# EAGLE design PCU_Testboard (EAGLE 9.5.1)

## Sheet 1 of 6: Connectors
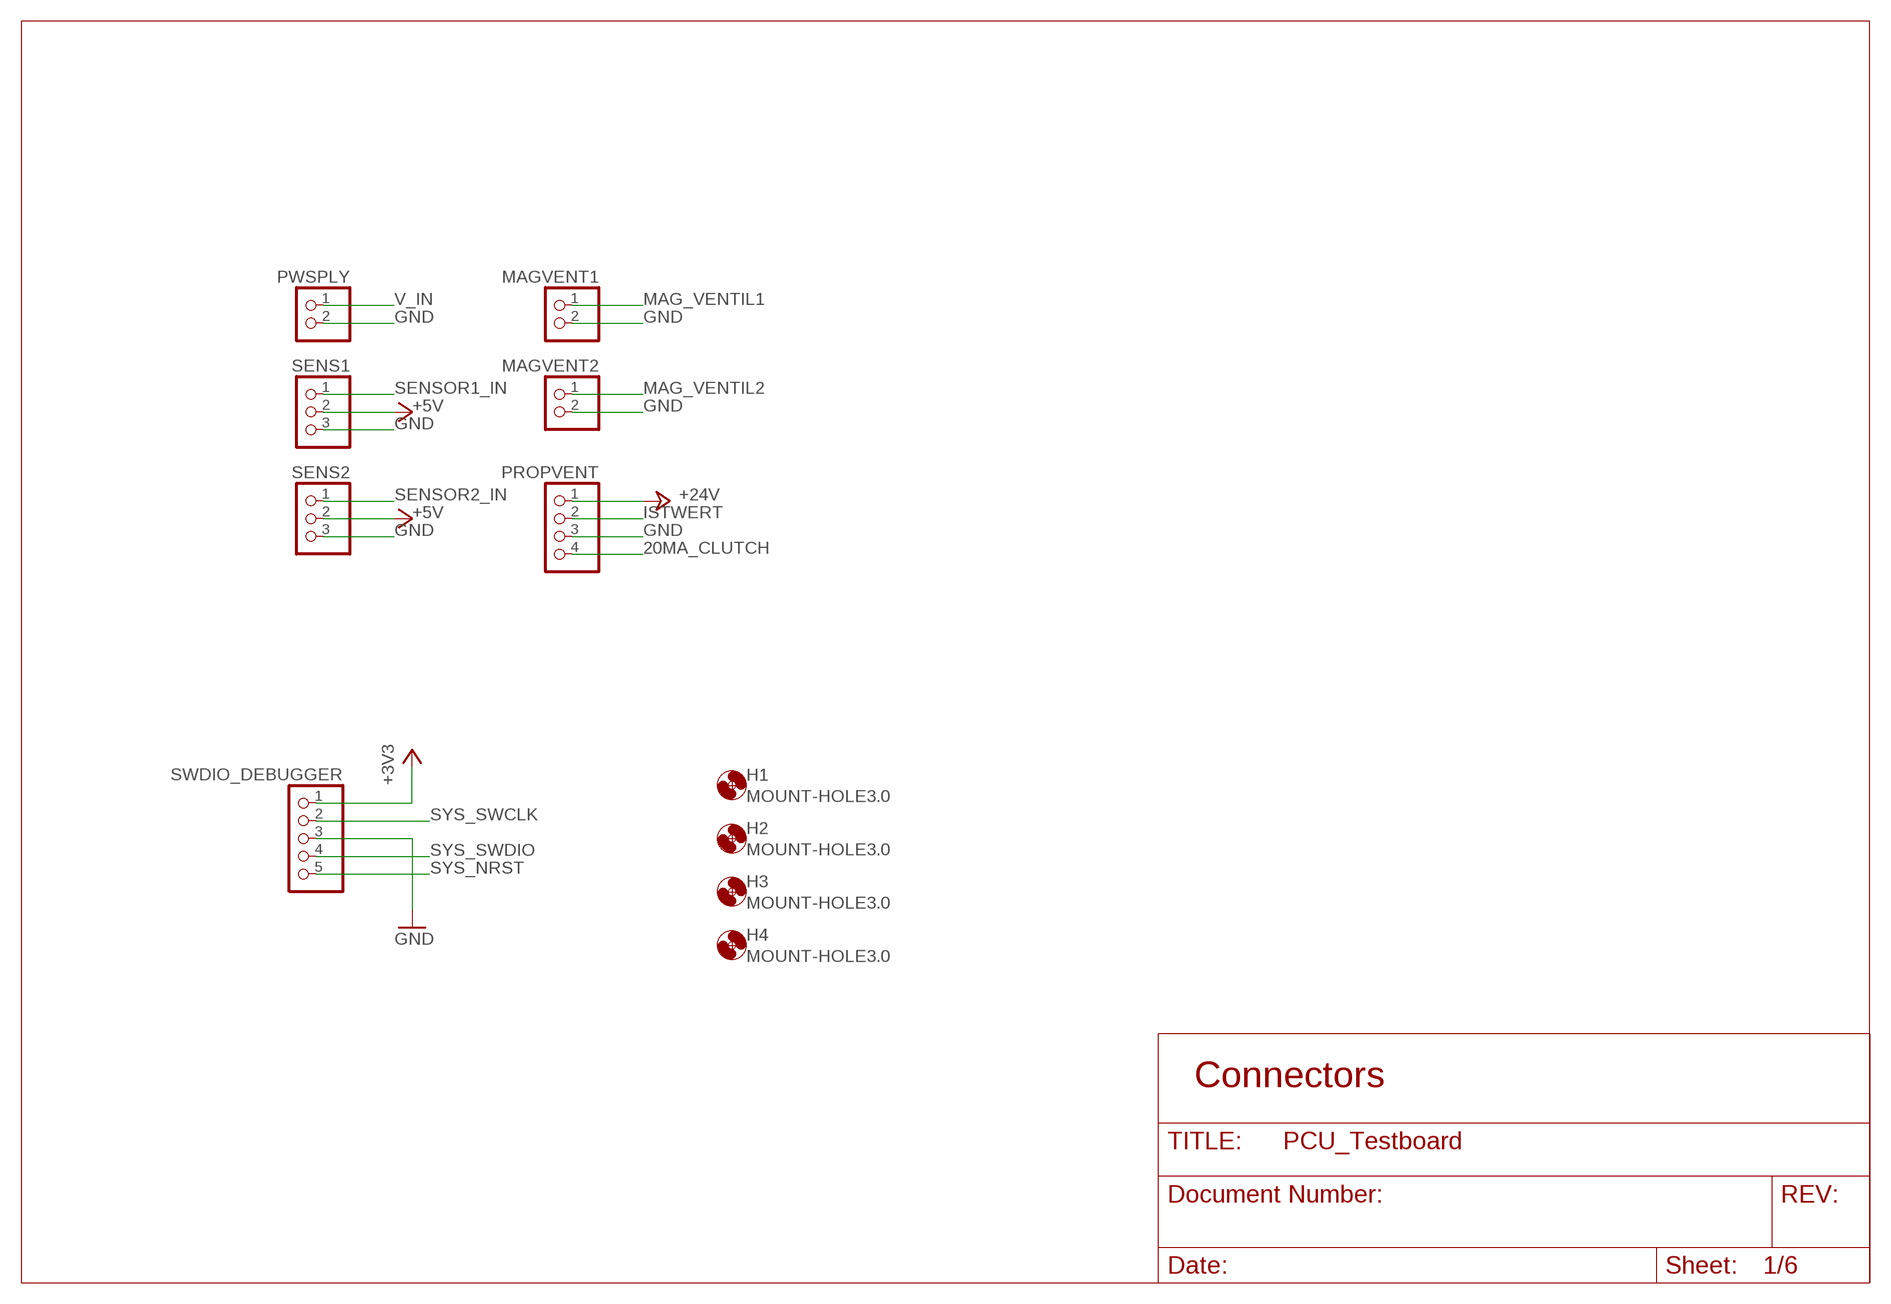
[diagram p0: schematic, sheet 1]

### Parts
H1  MOUNT-HOLE3.0  [3,0]
H2  MOUNT-HOLE3.0  [3,0]
H3  MOUNT-HOLE3.0  [3,0]
H4  MOUNT-HOLE3.0  [3,0]
MAGVENT1  PINHD-1X2  [1X02]
MAGVENT2  PINHD-1X2  [1X02]
PROPVENT  PINHD-1X4  [1X04]
PWSPLY  PINHD-1X2  [1X02]
SENS1  PINHD-1X3  [1X03]
SENS2  PINHD-1X3  [1X03]
SWDIO_DEBUGGER  PINHD-1X5  [1X05]

### Nets
20MA_CLUTCH: PROPVENT.4 ; also sheet 4
+3V3: SWDIO_DEBUGGER.1 ; also sheet 2,3,5
+5V: SENS1.2 SENS2.2 ; also sheet 3,6
+24V: PROPVENT.1 ; also sheet 3,4
GND: MAGVENT1.2 MAGVENT2.2 PROPVENT.3 PWSPLY.2 SENS1.3 SENS2.3 SWDIO_DEBUGGER.3 ; also sheet 2,3,4,5,6
ISTWERT: PROPVENT.2 ; also sheet 2,5
MAG_VENTIL1: MAGVENT1.1 ; also sheet 4
MAG_VENTIL2: MAGVENT2.1 ; also sheet 4
SENSOR1_IN: SENS1.1 ; also sheet 6
SENSOR2_IN: SENS2.1 ; also sheet 6
SYS_NRST: SWDIO_DEBUGGER.5
SYS_SWCLK: SWDIO_DEBUGGER.2 ; also sheet 2
SYS_SWDIO: SWDIO_DEBUGGER.4 ; also sheet 2
V_IN: PWSPLY.1 ; also sheet 3

### Notes on the sheet
- Connectors

## Sheet 2 of 6: Microcontroller Pinout
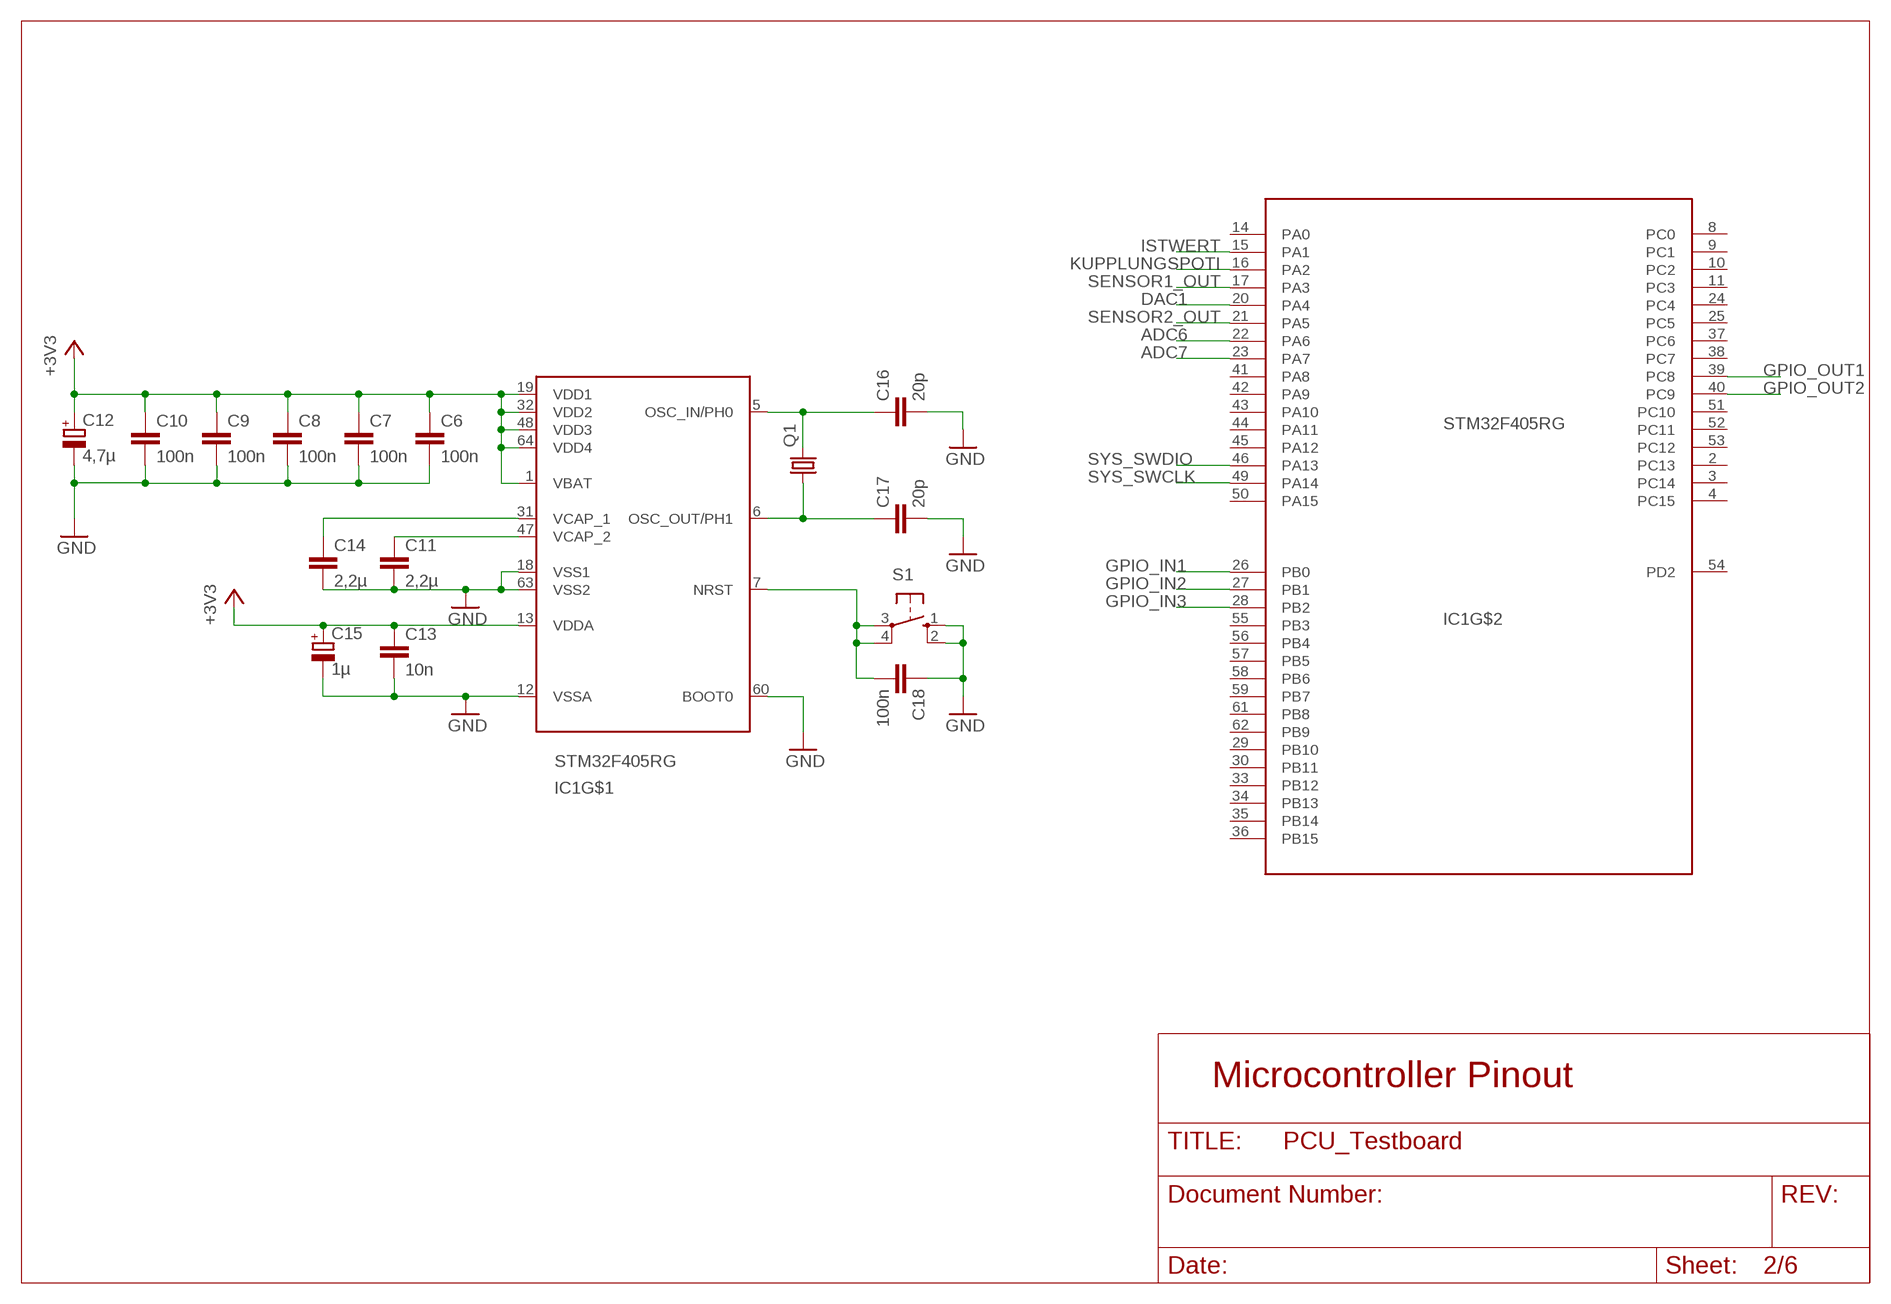
[diagram p1: schematic, sheet 2]

### Parts
C6  100n  C-EUC0603  [C0603]
C7  100n  C-EUC0603  [C0603]
C8  100n  C-EUC0603  [C0603]
C9  100n  C-EUC0603  [C0603]
C10  100n  C-EUC0603  [C0603]
C11  2,2µ  C-EUC0603  [C0603]
C12  4,7µ  CPOL-EU153CLV-0505  [153CLV-0505]
C13  10n  C-EUC0603  [C0603]
C14  2,2µ  C-EUC0603  [C0603]
C15  1µ  CPOL-EU153CLV-0505  [153CLV-0505]
C16  20p  C-EUC0603  [C0603]
C17  20p  C-EUC0603  [C0603]
C18  100n  C-EUC0603  [C0603]
IC1  STM32F405RG  [LQFP64]
Q1  CRYSTALHC49UP  [HC49UP]
S1  10-XX  [B3F-10XX]

### Nets
+3V3: C6.1 C7.1 C8.1 C9.1 C10.1 C12.+ C13.1 C15.+ IC1.1(VBAT) IC1.13(VDDA) IC1.19(VDD1) IC1.32(VDD2) IC1.48(VDD3) IC1.64(VDD4) ; also sheet 1,3,5
ADC6: IC1.22(PA6)
ADC7: IC1.23(PA7)
DAC1: IC1.20(PA4) ; also sheet 4
GND: C6.2 C7.2 C8.2 C9.2 C10.2 C11.2 C12.- C13.2 C14.2 C15.- C16.2 C17.2 C18.1 IC1.12(VSSA) IC1.18(VSS1) IC1.60(BOOT0) IC1.63(VSS2) S1.1(S) S1.2(S1) ; also sheet 1,3,4,5,6
GPIO_IN1: IC1.26(PB0) ; also sheet 5
GPIO_IN2: IC1.27(PB1) ; also sheet 5
GPIO_IN3: IC1.28(PB2) ; also sheet 5
GPIO_OUT1: IC1.39(PC8) ; also sheet 4
GPIO_OUT2: IC1.40(PC9) ; also sheet 4
ISTWERT: IC1.15(PA1) ; also sheet 1,5
KUPPLUNGSPOTI: IC1.16(PA2) ; also sheet 5
N$1: C14.1 IC1.31(VCAP_1)
N$2: C11.1 IC1.47(VCAP_2)
N$5: C16.1 IC1.5(OSC_IN/PH0) Q1.2
N$6: C17.1 IC1.6(OSC_OUT/PH1) Q1.1
N$8: C18.2 IC1.7(NRST) S1.3(P) S1.4(P1)
SENSOR1_OUT: IC1.17(PA3) ; also sheet 6
SENSOR2_OUT: IC1.21(PA5) ; also sheet 6
SYS_SWCLK: IC1.49(PA14) ; also sheet 1
SYS_SWDIO: IC1.46(PA13) ; also sheet 1
Unconnected: IC1.2(PC13) IC1.3(PC14) IC1.4(PC15) IC1.8(PC0) IC1.9(PC1) IC1.10(PC2) IC1.11(PC3) IC1.14(PA0) IC1.24(PC4) IC1.25(PC5) IC1.29(PB10) IC1.30(PB11) IC1.33(PB12) IC1.34(PB13) IC1.35(PB14) IC1.36(PB15) IC1.37(PC6) IC1.38(PC7) IC1.41(PA8) IC1.42(PA9) IC1.43(PA10) IC1.44(PA11) IC1.45(PA12) IC1.50(PA15) IC1.51(PC10) IC1.52(PC11) IC1.53(PC12) IC1.54(PD2) IC1.55(PB3) IC1.56(PB4) IC1.57(PB5) IC1.58(PB6) IC1.59(PB7) IC1.61(PB8) IC1.62(PB9)

### Notes on the sheet
- Microcontroller Pinout

## Sheet 3 of 6: Power Supply
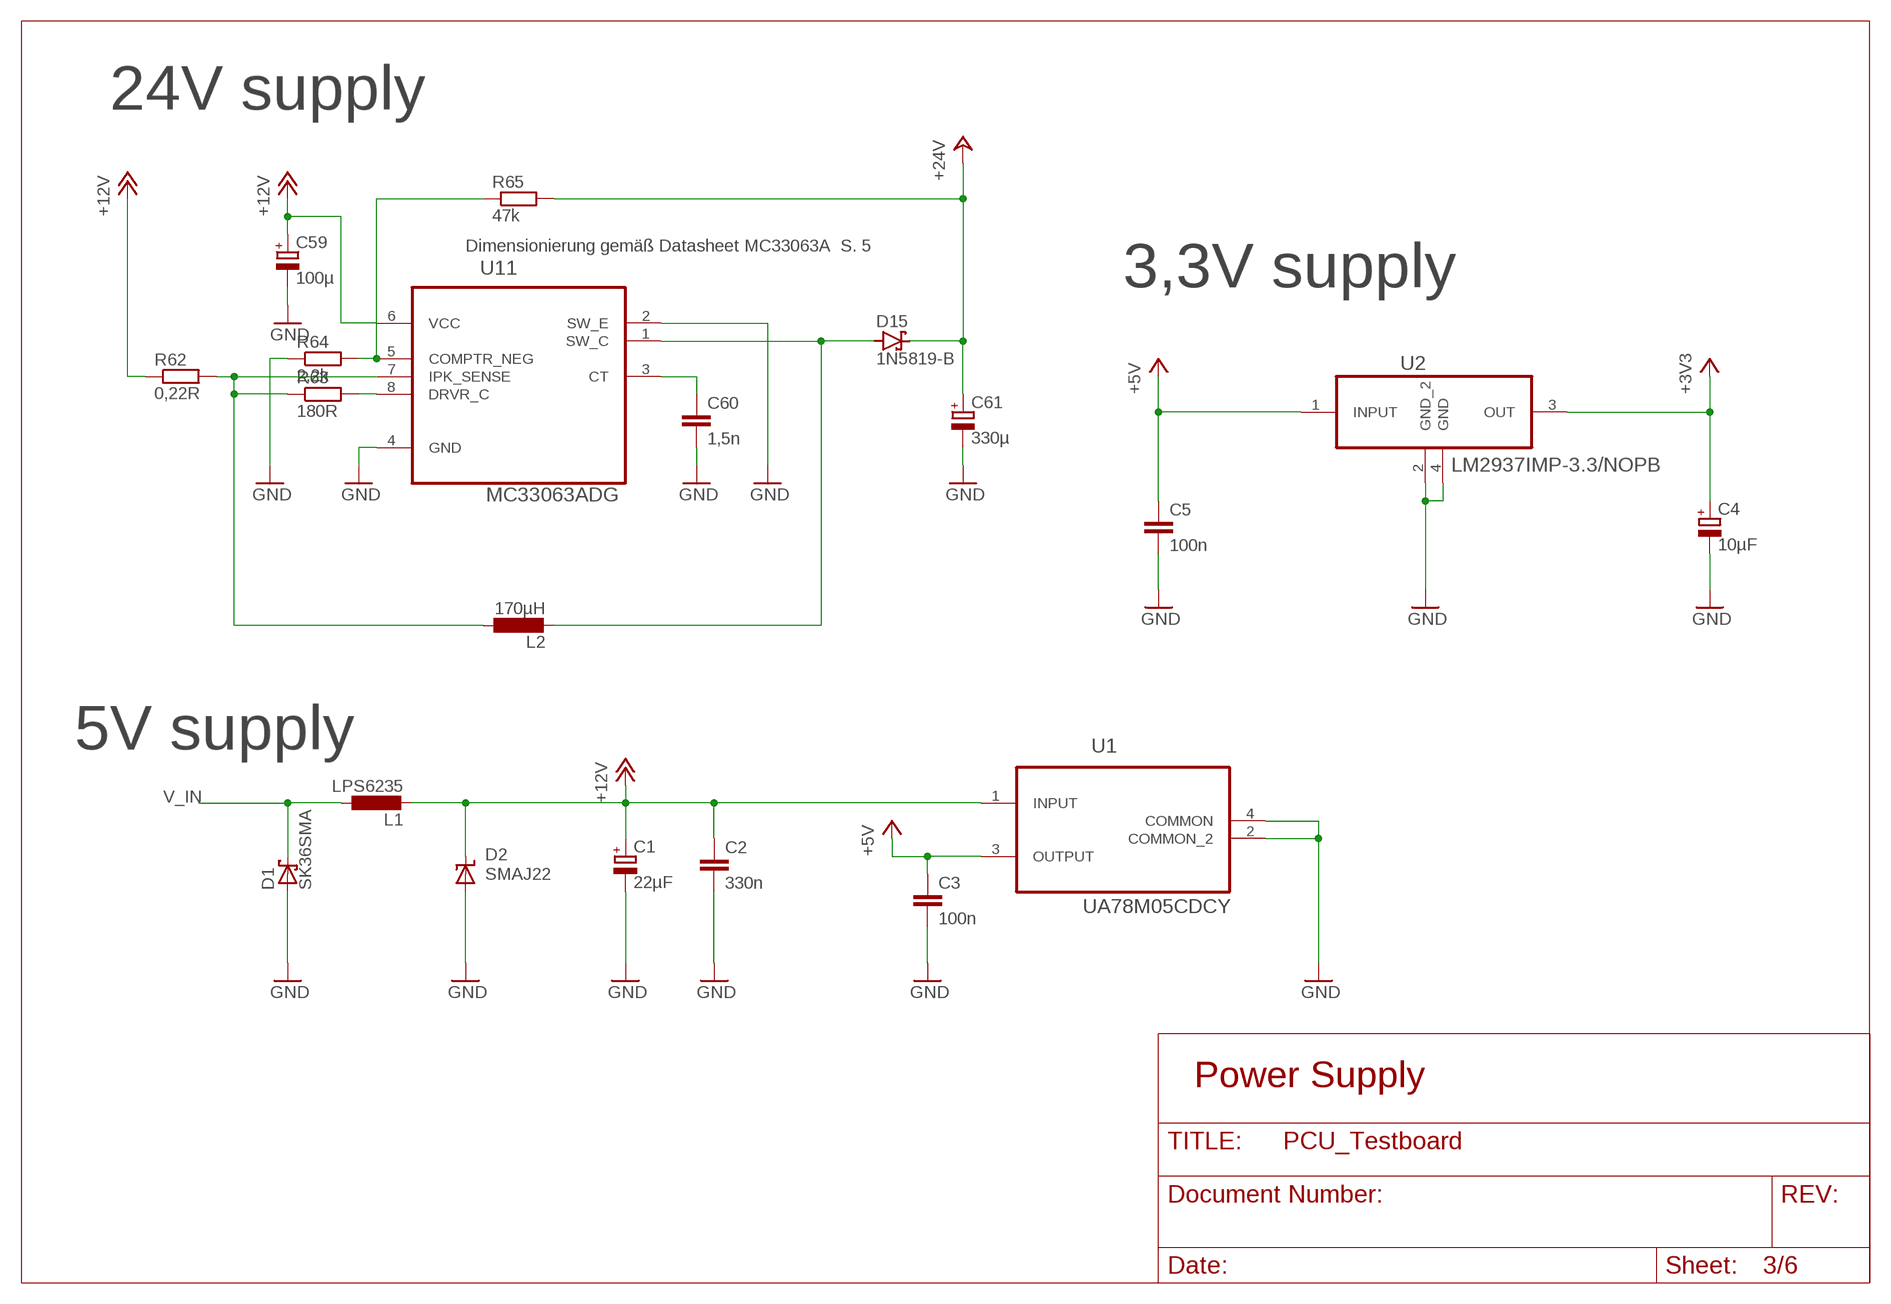
[diagram p2: schematic, sheet 3]

### Parts
C1  22µF  CPOL-EU153CLV-0605  [153CLV-0605]
C2  330n  C-EUC0603  [C0603]
C3  100n  C-EUC0603  [C0603]
C4  10µF  CPOL-EU153CLV-0807  [153CLV-0807]
C5  100n  C-EUC0603  [C0603]
C59  100µ  CPOL-EU150CLZ-0810  [150CLZ-0810]
C60  1,5n  C-EUC0603  [C0603]
C61  330µ  CPOL-EU153CLV-1010  [153CLV-1010]
D1  SK36SMA  [DO214AC]
D2  SMAJ22  [SMA-DO214AC]
D15  1N5819-B  [DO41-7.6]
L1  LPS6235  [LPS6235]
L2  170µH  LPS6235  [LPS6235]
R62  0,22R  R-EU_R0603  [R0603]
R63  180R  R-EU_R0603  [R0603]
R64  2,2k  R-EU_R0603  [R0603]
R65  47k  R-EU_R0603  [R0603]
U1  UA78M05CDCY  [SOT230P700X180-4N]
U2  LM2937IMP-3.3/NOPB  [SOT230P700X180-4N]
U11  MC33063ADG  [SOIC127P600X175-8N]

### Nets
+3V3: C4.+ U2.3(OUT) ; also sheet 1,2,5
+5V: C3.1 C5.1 U1.3(OUTPUT) U2.1(INPUT) ; also sheet 1,6
+12V: C1.+ C2.1 C59.+ D2.K(C) L1.2 R62.1 U1.1(INPUT) U11.6(VCC) ; also sheet 4
+24V: C61.+ D15.C R65.2 ; also sheet 1,4
GND: C1.- C2.2 C3.2 C4.- C5.2 C59.- C60.2 C61.- D1.A D2.A R64.1 U1.2(COMMON_2) U1.4(COMMON) U2.2(GND_2) U2.4(GND) U11.2(SW_E) U11.4(GND) ; also sheet 1,2,4,5,6
N$58: C60.1 U11.3(CT)
N$59: L2.1 R62.2 R63.1 U11.7(IPK_SENSE)
N$60: R63.2 U11.8(DRVR_C)
N$61: D15.A L2.2 U11.1(SW_C)
N$62: R64.2 R65.1 U11.5(COMPTR_NEG)
V_IN: D1.C L1.1 ; also sheet 1

### Notes on the sheet
- 24V supply
- Dimensionierung gemäß Datasheet MC33063A  S. 5
- 3,3V supply
- 5V supply
- Power Supply

## Sheet 4 of 6: Controlsignals
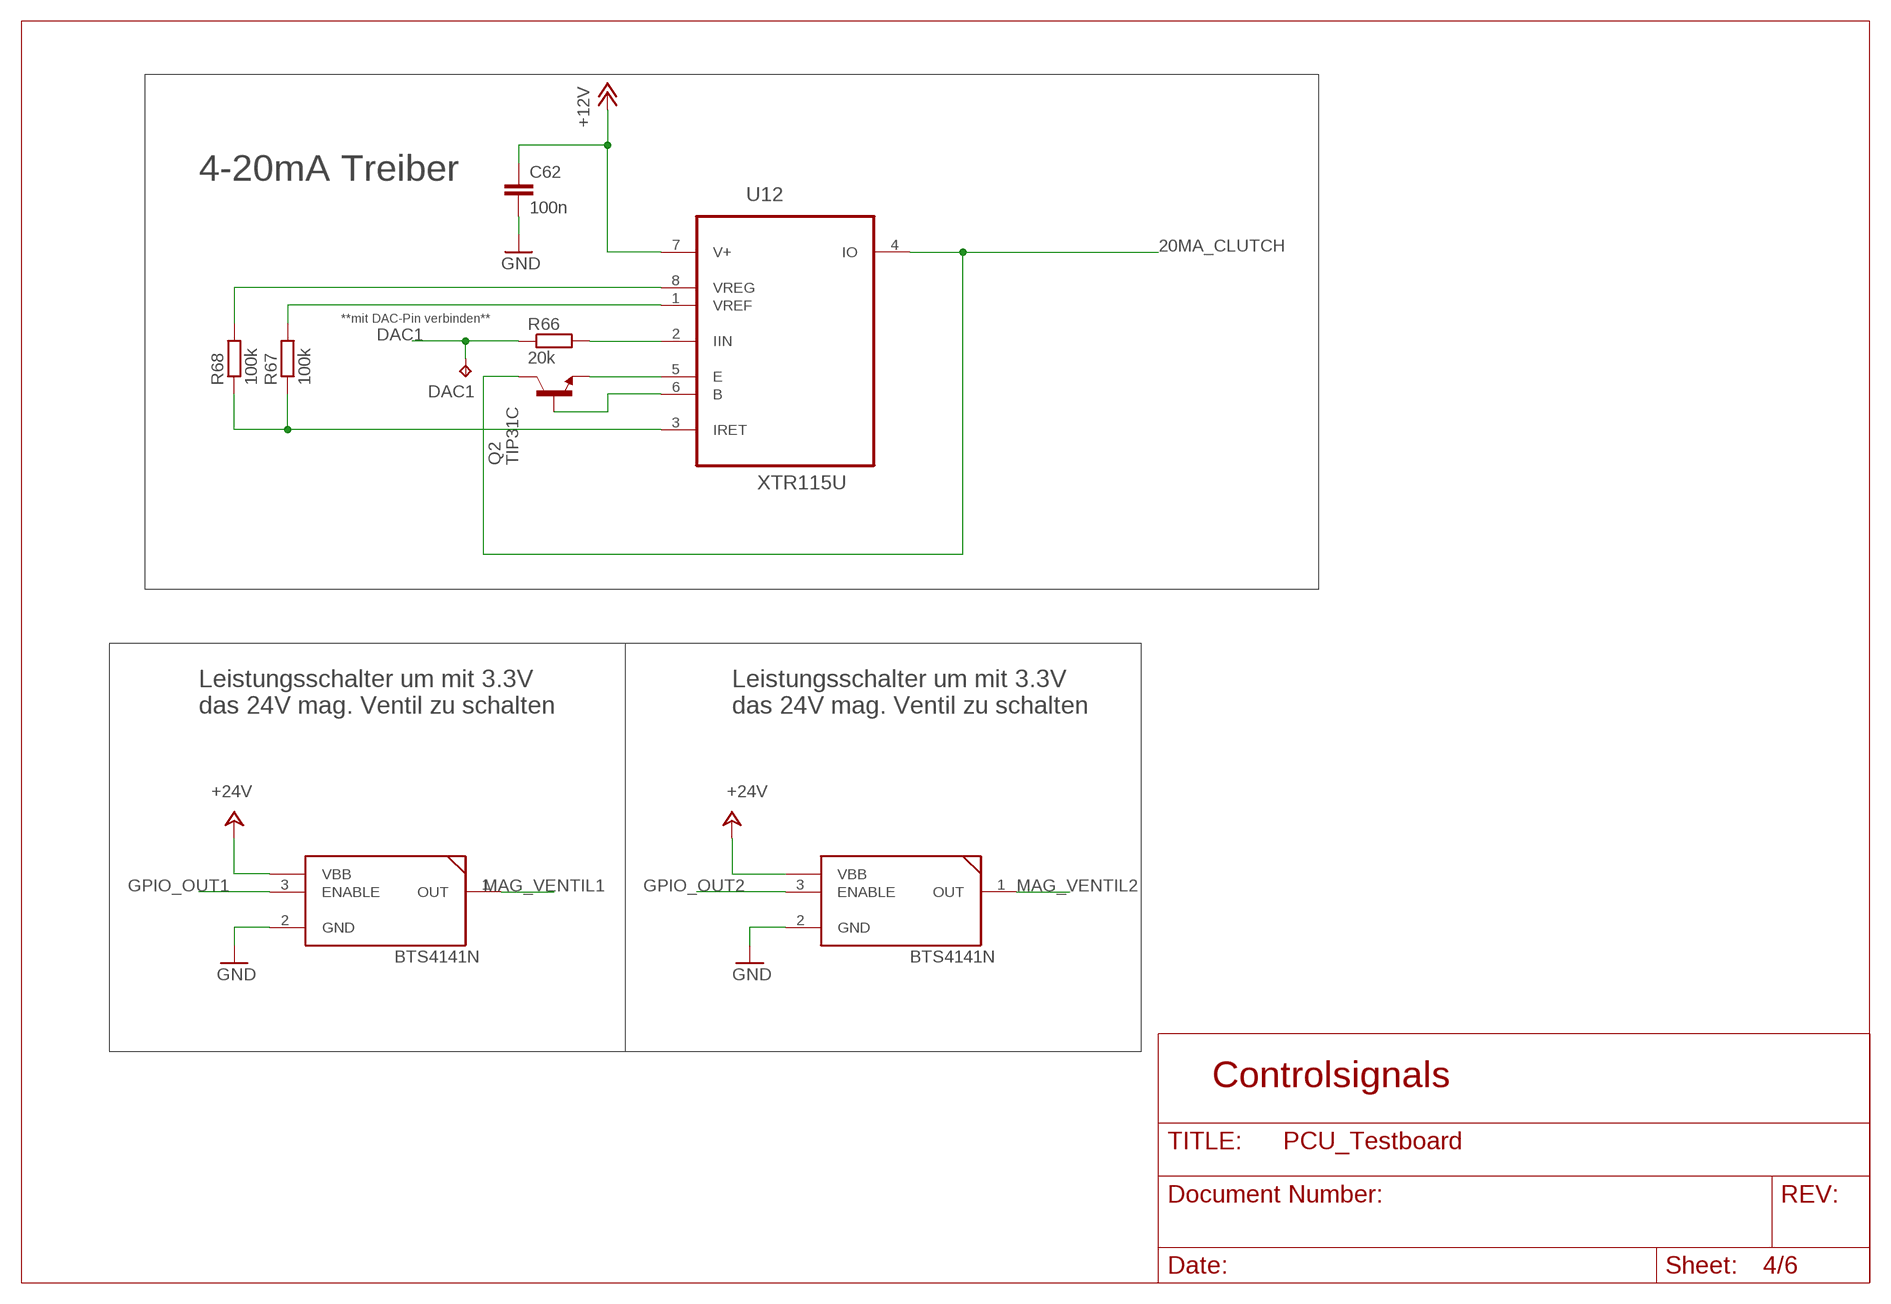
[diagram p3: schematic, sheet 4]

### Parts
C62  100n  C-EUC0603  [C0603]
DAC1  TPB1,27  [B1,27]
Q2  TIP31C  [TO220]
R66  20k  R-EU_R0603  [R0603]
R67  100k  R-EU_R0603  [R0603]
R68  100k  R-EU_R0603  [R0603]
U12  XTR115U  [SOIC127P600X175-8N]
U$1  BTS4141N  [SOT223]
U$4  BTS4141N  [SOT223]

### Nets
20MA_CLUTCH: Q2.2(C) U12.4(IO) ; also sheet 1
+12V: C62.1 U12.7(V+) ; also sheet 3
+24V: U$1.4(VBB) U$4.4(VBB) ; also sheet 1,3
DAC1: DAC1.TP R66.1 ; also sheet 2
GND: C62.2 U$1.2(GND) U$4.2(GND) ; also sheet 1,2,3,5,6
GPIO_OUT1: U$1.3(ENABLE) ; also sheet 2
GPIO_OUT2: U$4.3(ENABLE) ; also sheet 2
MAG_VENTIL1: U$1.1(OUT) ; also sheet 1
MAG_VENTIL2: U$4.1(OUT) ; also sheet 1
N$63: R66.2 U12.2(IIN)
N$65: Q2.3(E) U12.5(E)
N$67: Q2.1(B) U12.6(B)
N$68: R67.2 U12.1(VREF)
N$69: R68.2 U12.8(VREG)
N$70: R67.1 R68.1 U12.3(IRET)

### Notes on the sheet
- 4-20mA Treiber
- **mit DAC-Pin verbinden**
- Leistungsschalter um mit 3.3V
  das 24V mag. Ventil zu schalten
- Leistungsschalter um mit 3.3V
  das 24V mag. Ventil zu schalten
- Controlsignals

## Sheet 5 of 6: OnBoard Peripherie
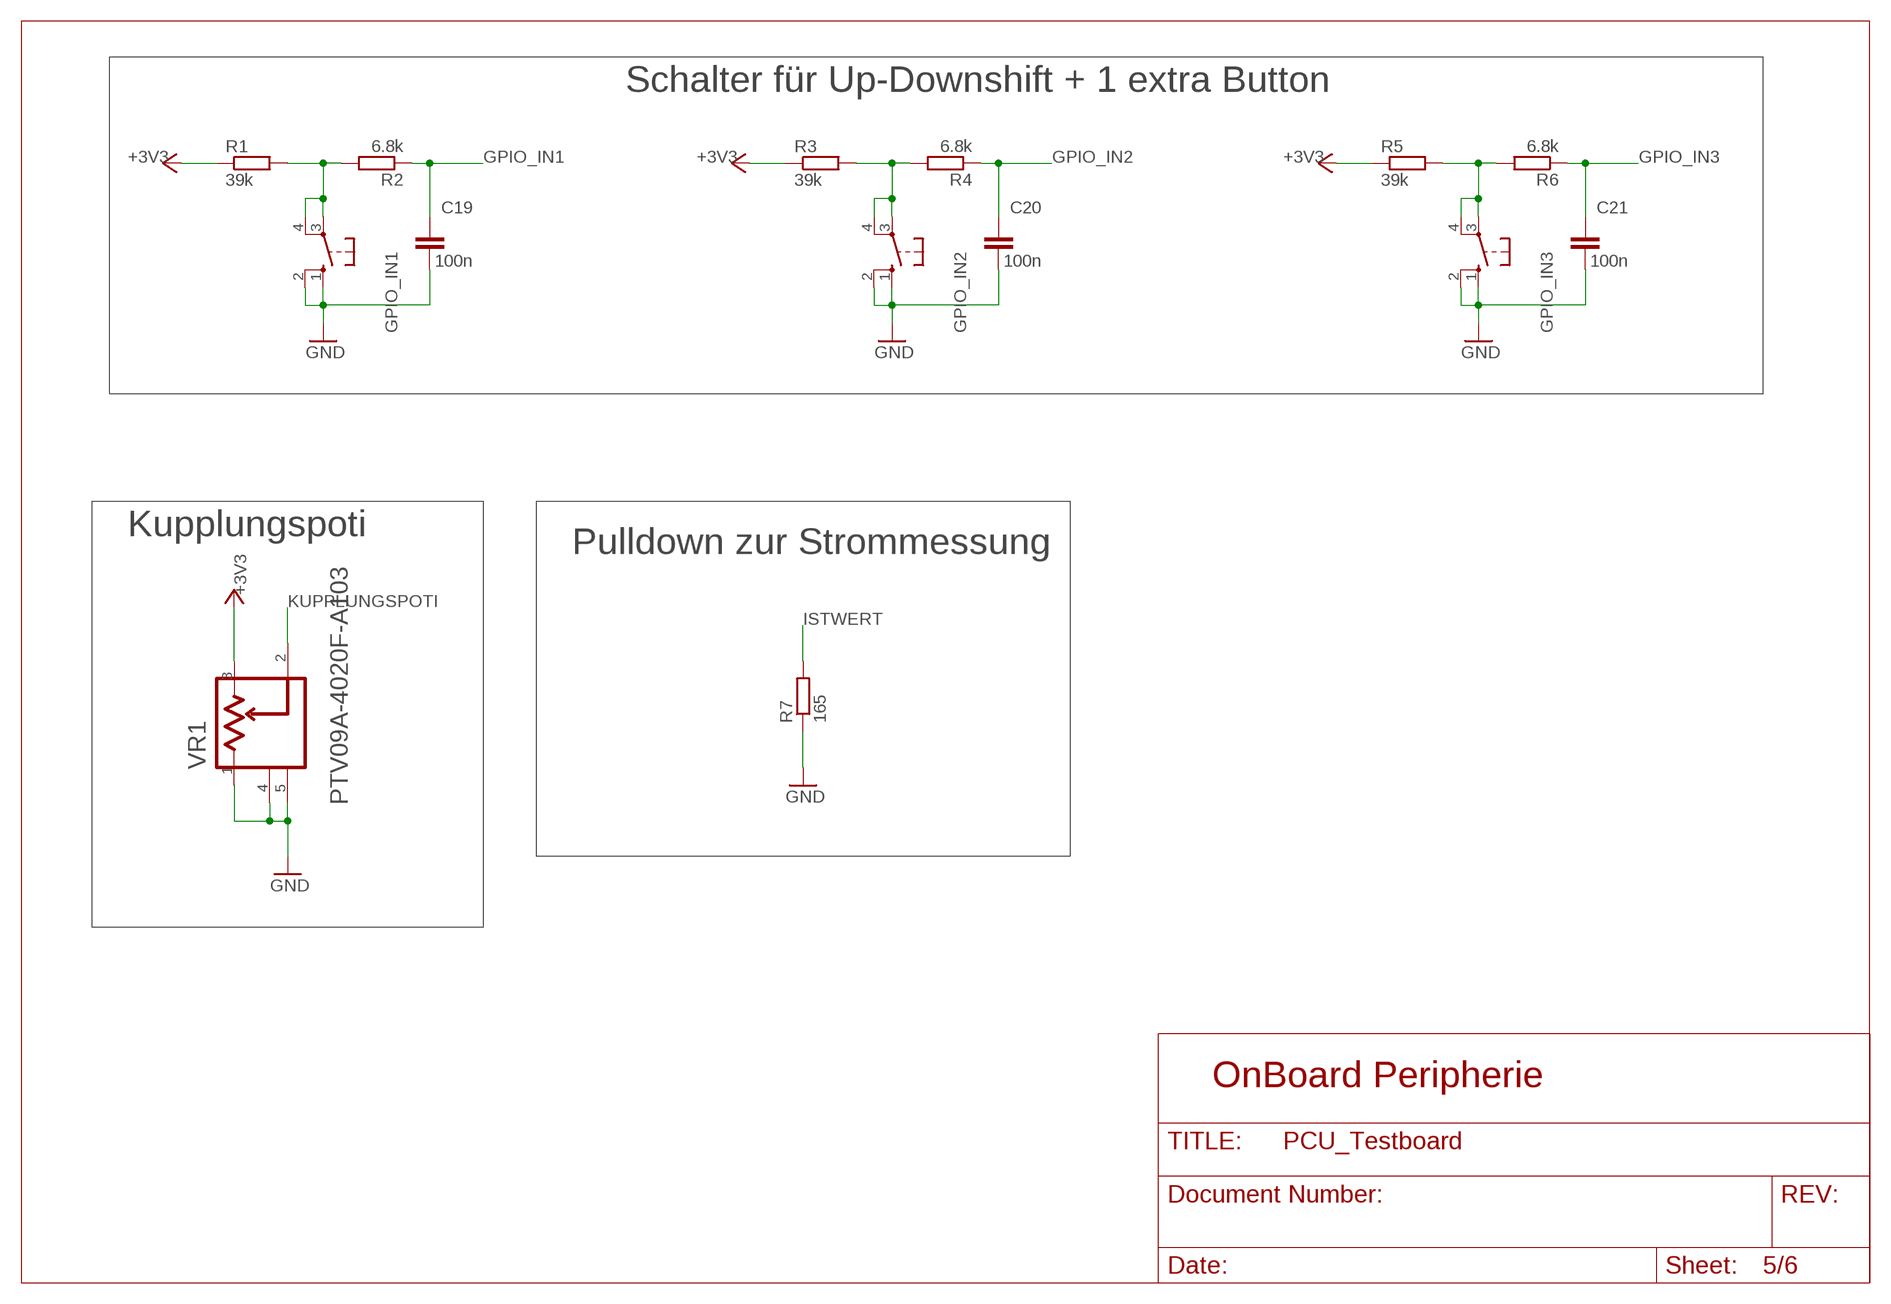
[diagram p4: schematic, sheet 5]

### Parts
C19  100n  C-EUC0603  [C0603]
C20  100n  C-EUC0603  [C0603]
C21  100n  C-EUC0603  [C0603]
GPIO_IN1  10-XX  [B3F-10XX]
GPIO_IN2  10-XX  [B3F-10XX]
GPIO_IN3  10-XX  [B3F-10XX]
R1  39k  R-EU_R0805  [R0805]
R2  6.8k  R-EU_R0805  [R0805]
R3  39k  R-EU_R0805  [R0805]
R4  6.8k  R-EU_R0805  [R0805]
R5  39k  R-EU_R0805  [R0805]
R6  6.8k  R-EU_R0805  [R0805]
R7  165  R-EU_R0805  [R0805]
VR1  BOURNS_PTV09A-4020F-A103BOURNS_PTV09A-4020F-A103_0_0  [BOURNS_PTV09A-4020F-A103_0]

### Nets
+3V3: R1.1 R3.1 R5.1 VR1.3 ; also sheet 1,2,3
GND: C19.2 C20.2 C21.2 GPIO_IN1.1(S) GPIO_IN1.2(S1) GPIO_IN2.1(S) GPIO_IN2.2(S1) GPIO_IN3.1(S) GPIO_IN3.2(S1) R7.1 VR1.1 VR1.4(MNT_1) VR1.5(MNT_2) ; also sheet 1,2,3,4,6
GPIO_IN1: C19.1 R2.1 ; also sheet 2
GPIO_IN2: C20.1 R4.1 ; also sheet 2
GPIO_IN3: C21.1 R6.1 ; also sheet 2
ISTWERT: R7.2 ; also sheet 1,2
KUPPLUNGSPOTI: VR1.2 ; also sheet 2
N$4: GPIO_IN1.3(P) GPIO_IN1.4(P1) R1.2 R2.2
N$7: GPIO_IN2.3(P) GPIO_IN2.4(P1) R3.2 R4.2
N$19: GPIO_IN3.3(P) GPIO_IN3.4(P1) R5.2 R6.2

### Notes on the sheet
- Schalter für Up-Downshift + 1 extra Button
- Kupplungspoti
- Pulldown zur Strommessung
- OnBoard Peripherie

## Sheet 6 of 6: Sensorsignals
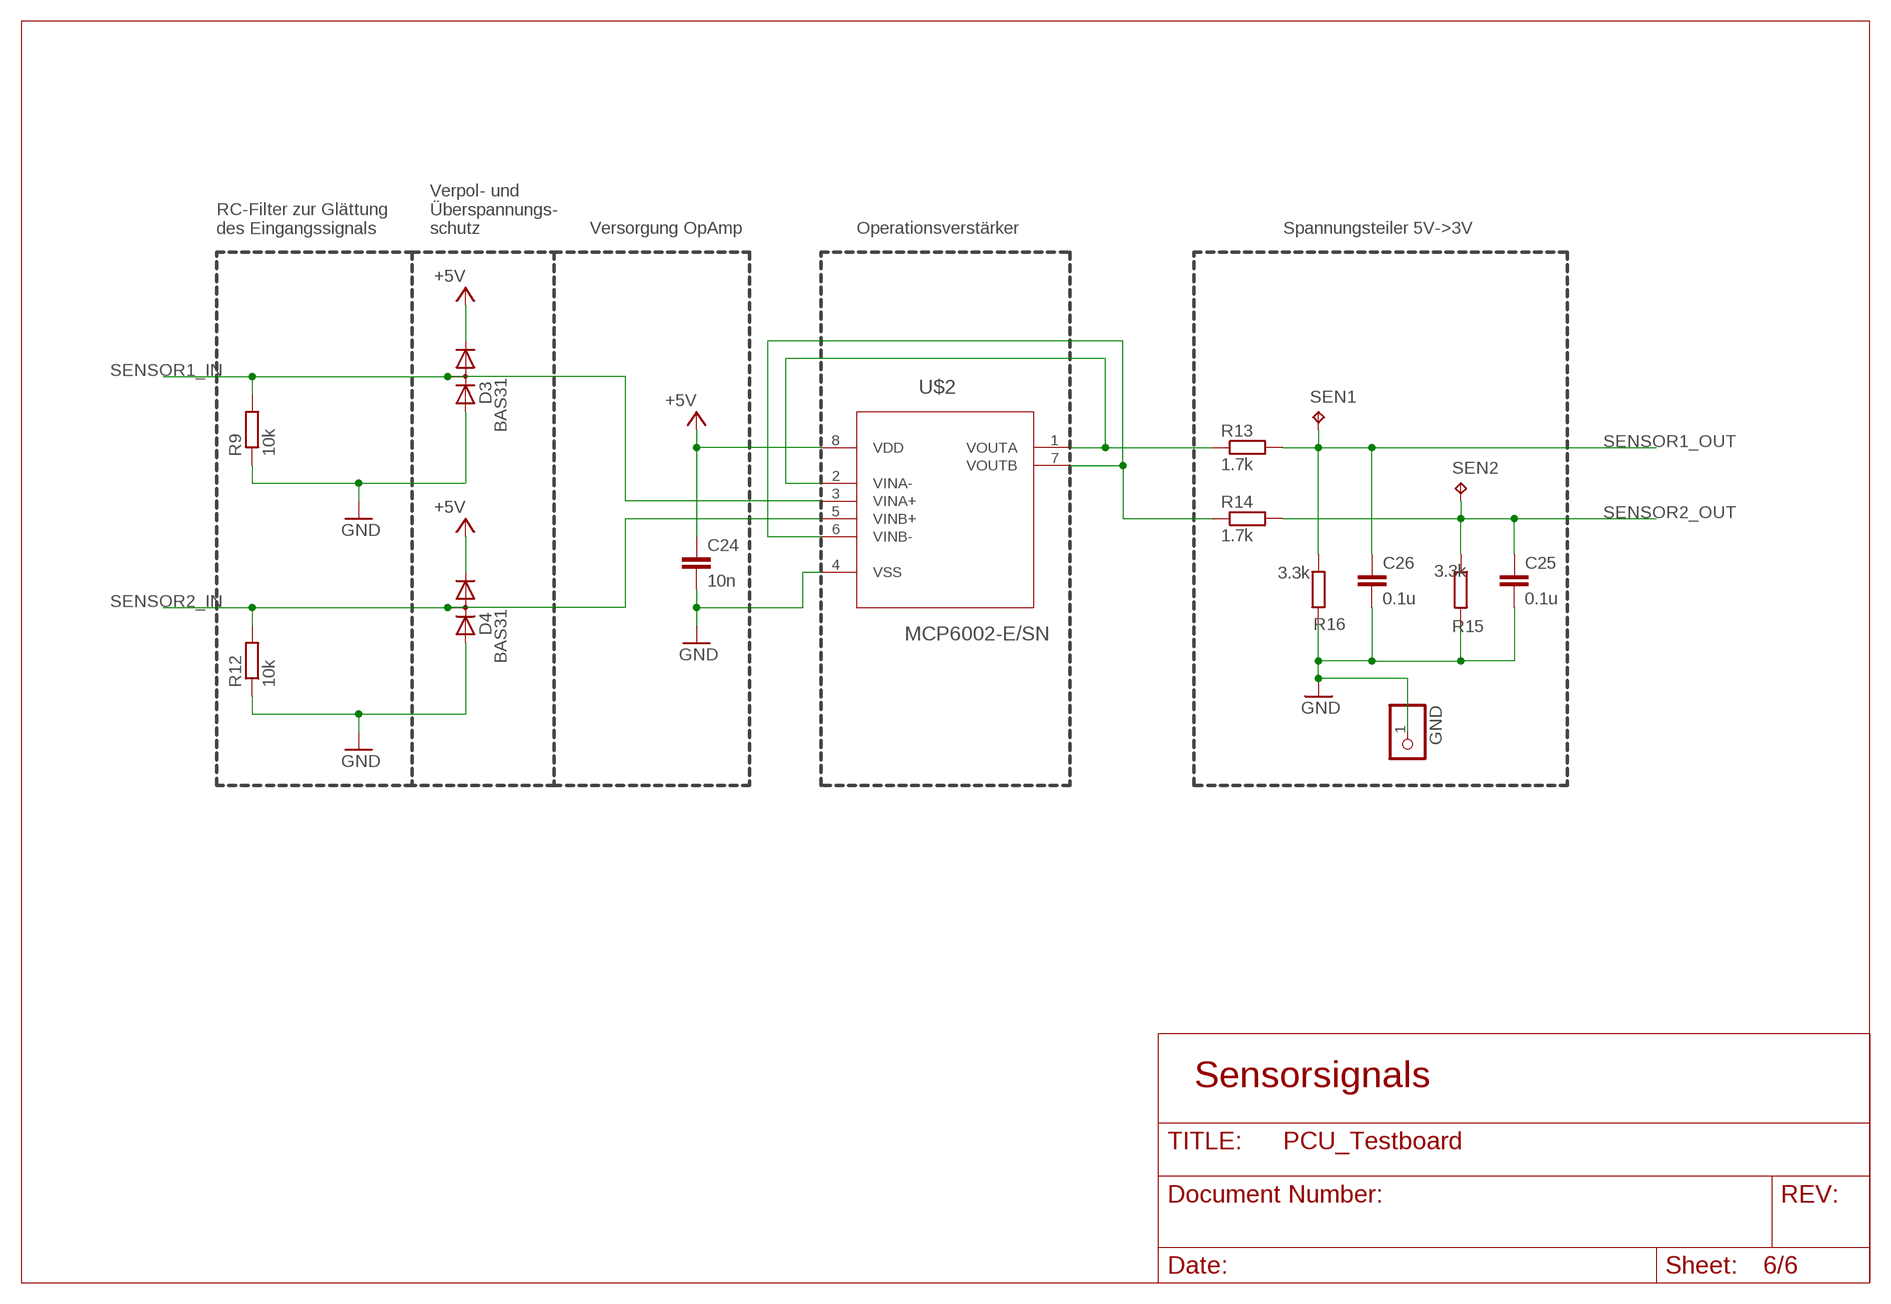
[diagram p5: schematic, sheet 6]

### Parts
C24  10n  C-EUC0603  [C0603]
C25  0.1u  C-EUC0603  [C0603]
C26  0.1u  C-EUC0603  [C0603]
D3  BAS31  [SOT23]
D4  BAS31  [SOT23]
GND  PINHD-1X1  [1X01]
R9  10k  R-EU_R0805  [R0805]
R12  10k  R-EU_R0805  [R0805]
R13  1.7k  R-EU_R0805  [R0805]
R14  1.7k  R-EU_R0805  [R0805]
R15  3.3k  R-EU_R0805  [R0805]
R16  3.3k  R-EU_R0805  [R0805]
SEN1  TPB1,27  [B1,27]
SEN2  TPB1,27  [B1,27]
U$2  MCP6002-E/SN  [SOIC127P600X175-8N]

### Nets
+5V: C24.1 D3.2(C) D4.2(C) U$2.8(VDD) ; also sheet 1,3
GND: C24.2 C25.2 C26.2 D3.1(A) D4.1(A) GND.1 R9.1 R12.1 R15.2 R16.1 U$2.4(VSS) ; also sheet 1,2,3,4,5
N$15: R13.1 U$2.1(VOUTA) U$2.2(VINA-)
N$17: R14.1 U$2.6(VINB-) U$2.7(VOUTB)
SENSOR1_IN: D3.3(AC) R9.2 U$2.3(VINA+) ; also sheet 1
SENSOR1_OUT: C26.1 R13.2 R16.2 SEN1.TP ; also sheet 2
SENSOR2_IN: D4.3(AC) R12.2 U$2.5(VINB+) ; also sheet 1
SENSOR2_OUT: C25.1 R14.2 R15.1 SEN2.TP ; also sheet 2

### Notes on the sheet
- RC-Filter zur Glättung
  des Eingangssignals
- Verpol- und
  Überspannungs-
  schutz
- Versorgung OpAmp | Operationsverstärker | Spannungsteiler 5V->3V
- Sensorsignals

## Library data of the parts
C1 C4 C12 C15 C59 C61 = rcl:CPOL-EU: POLARIZED CAPACITOR, European symbol; SPICEPREFIX: C
C2 C3 C5-C11 C13 C14 C16-C21 C24-C26 C60 C62 = rcl:C-EU: CAPACITOR, European symbol; SPICEPREFIX: C
D1 = RUBM_PARTS:SK36SMA
D2 = RUBM_PARTS:SMAJ22: The SMAJ22A from Taiwan Semiconductor is a SMAJ series unidirectional surface mount transient voltage suppressor in DO-214AC package. It has low profile package, excellent clamping capability and glass passivated junction. This transient voltage suppressor is ideal for automated placement. The leads are matte tin plated and solderable per JESD22-B102. It also meets JESD 201 class 2 whisker test.
D3 D4 = RUBM_PARTS:BAS31
D15 = diode:1N581*: 1.0A SCHOTTKY BARRIER RECTIFIER Source: http://www.diodes.com/datasheets/ds23001.pdf
DAC1 SEN1 SEN2 = testpad:TP: Test pad
GND = pinhead:PINHD-1X1: PIN HEADER
GPIO_IN1-GPIO_IN3 S1 = switch-omron:10-XX: OMRON SWITCH; MPN: B3F-1000; OC_FARNELL: 176432; OC_NEWARK: 36M3542
H1-H4 = holes:MOUNT-HOLE: MOUNTING HOLE with drill center marker
IC1 = RUBM_PARTS:STM32F405RG
L1 L2 = RUBM_PARTS:LPS6235
MAGVENT1 MAGVENT2 PWSPLY = pinhead:PINHD-1X2: PIN HEADER
PROPVENT = pinhead:PINHD-1X4: PIN HEADER
Q1 = crystal:CRYSTAL: CRYSTAL; OC_FARNELL: unknown; OC_NEWARK: unknown
Q2 = transistor-npn:TIP31C*: NPN Transistor
R1-R7 R9 R12-R16 R62-R68 = rcl:R-EU_: RESISTOR, European symbol; SPICEPREFIX: R
SENS1 SENS2 = pinhead:PINHD-1X3: PIN HEADER
SWDIO_DEBUGGER = pinhead:PINHD-1X5: PIN HEADER
U1 = RUBM_PARTS:UA78M05CDCY: IC, LINEAR VOLT REGULATOR, 5V; MPN: UA78M05CDCY; OC_FARNELL: 2296030; OC_NEWARK: 77C1885; PACKAGE: SOT-223-3; SUPPLIER: TEXAS INSTRUMENTS
U2 = RUBM_PARTS:LM2937IMP-3.3/NOPB: LDO,3.3V 400mA and 500mA Voltage Regulators, SOT223-3; MPN: LM2937IMP-3.3/NOPB; OC_FARNELL: 2296021; OC_NEWARK: 28K1907; PACKAGE: SOT223-3; SUPPLIER: TEXAS INSTRUMENTS
U11 = ON Semiconductor_By_element14_Batch_1:MC33063ADG: Step-Up/Down/Inverting Switching Regulators; MPN: MC33063ADG; OC_FARNELL: 9664440; OC_NEWARK: 88H4720; PACKAGE: SOIC-8; SUPPLIER: ON Semiconductor
U12 = Texas Instruments_By_element14_Batch_1:XTR115U: CURRENT LOOP TRANSMITTERS; MPN: XTR115U; OC_FARNELL: 1212354; OC_NEWARK: 77C3651; PACKAGE: SOIC-8; SUPPLIER: TI
U$1 U$4 = bts4141n:BTS4141N
U$2 = Microchip_By_element14_Batch_1:MCP6002-E/SN: Low-Power Op Amp; DESCRIPTION: Low-Power Op Amp; MPN: MCP6002-E/SN; OC_FARNELL: 1332118; OC_NEWARK: 34M7473; PACKAGE: SOIC-8; SUPPLIER: Microchip
VR1 = Bourns - PTV09A-4020F-A103:BOURNS_PTV09A-4020F-A103: PTV09 series 9mm Potentiometer; CENTROID_NOT_SPECIFIED: No; DATASHEET: http://www.bourns.com/data/global/pdfs/PTV09.pdf; DIGIKEY_DESCRIPTION: RES POT 10K OHM 1/20W CARBON LOG; DIGIKEY_PART_NUMBER: PTV09A-4020F-A103-ND; LEAD_FREE: yes; MF: Bourns; MFG_PACKAGE_IDENT: PTV09A-4; MOUSER_PART_NUMBER: 652-PTV09A-4020FA103; MPN: PTV09A-4020F-A103; PACKAGE: POT_PTH_9MMO; POWER: 50mW; PREFIX: VR; RESISTANCE: 10k; ROHS: yes; TEMPERATURE_RANGE_HIGH: +50°C; TEMPERATURE_RANGE_LOW: -10°C

## Board
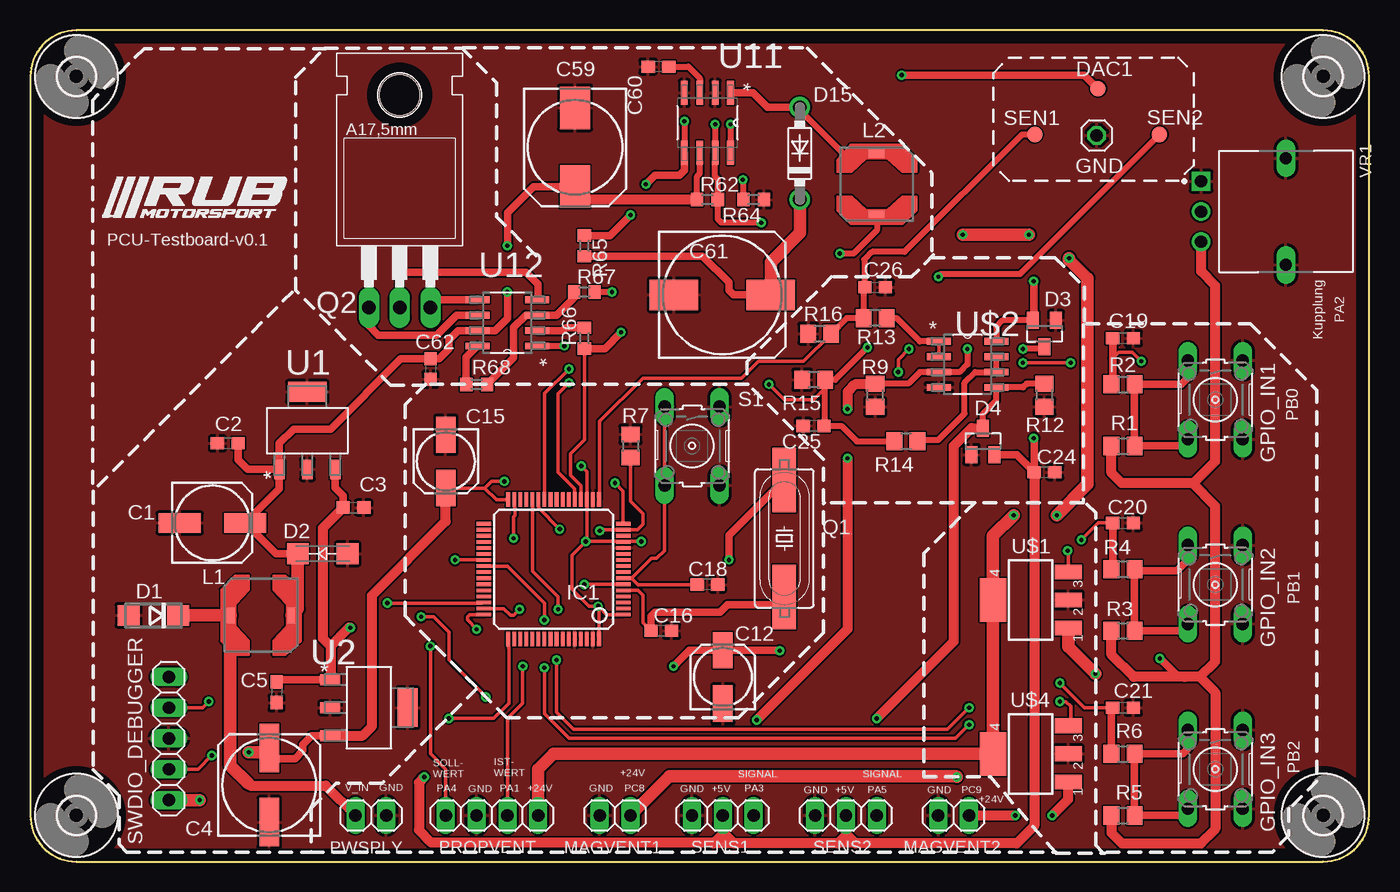
[diagram p6: board, top side]
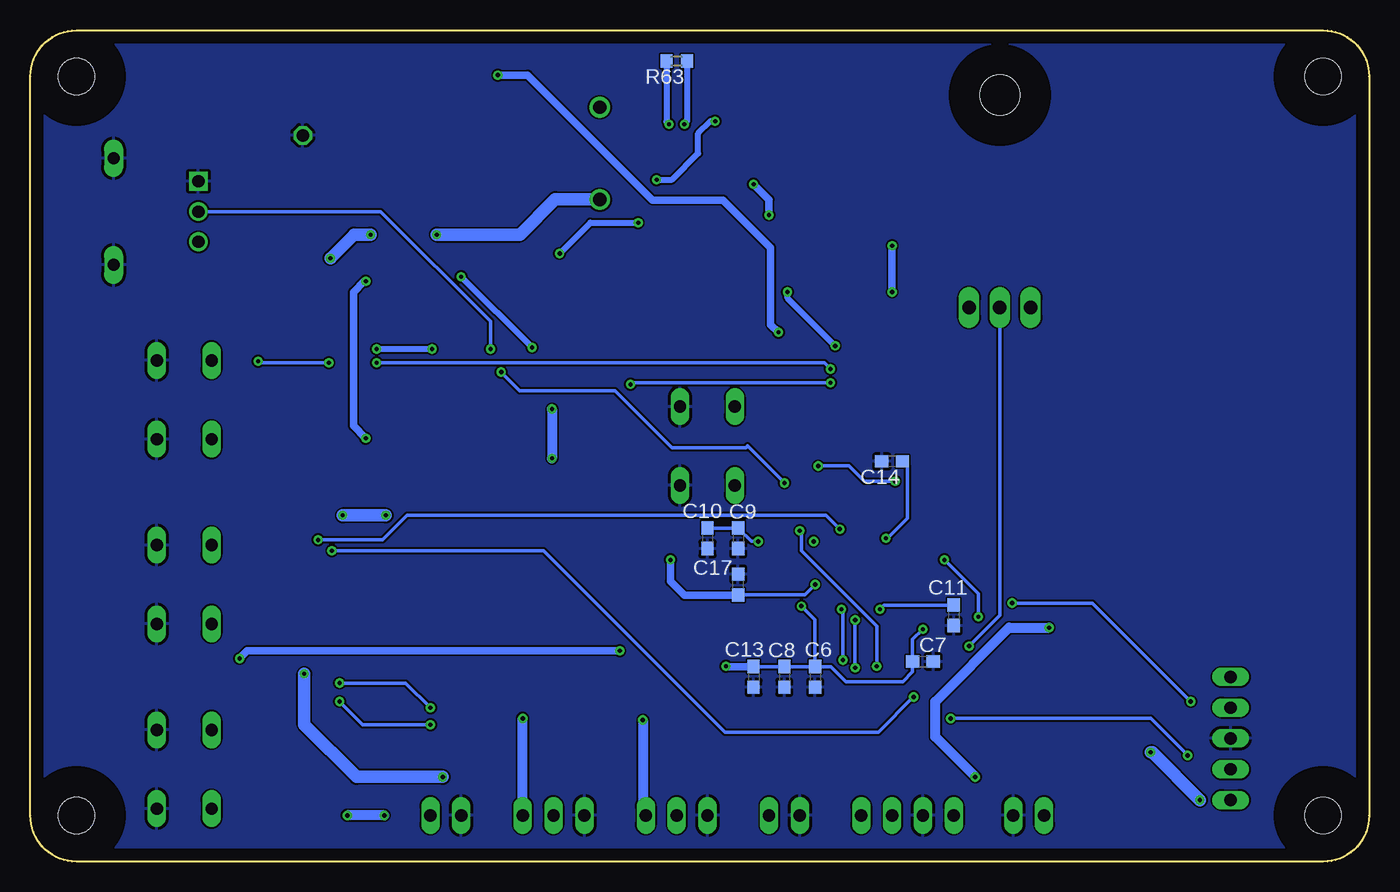
[diagram p7: board, bottom side, seen from below]

Size 110.49 x 68.58 mm. Coordinates in mm from the lower left corner, seen from the top.
Outline: 3.81,68.58 arc90 0,64.77 0,3.81 arc90 3.81,0 106.68,0 arc90 110.49,3.81 110.49,64.77 arc90 106.68,68.58 3.81,68.58
Copper layers (1*16): Top 0.035mm / dielectric 1.5mm / Bottom 0.035mm
Design rules "default": minimum track width 6mil, minimum drill 0.35mm, track to track 6mil, track to pad 6mil, pad to pad 6mil, via to via 6mil, smd to smd 6mil, copper to edge 40mil, drill to drill 6mil, minimum pad ring 10mil, minimum via ring 8mil, stop-mask expansion 4mil, vias tented up to drill 0mil, thermal gap 10mil

### Footprints (pad centres in the part's own frame; a part is rotated, then mirrored left to right if it is on the bottom)
153CLV-0605 = smd 3.5 x 1.6: + 2.7,0; - -2.7,0
C0603 = smd 1.1 x 1: 1 -0.85,0; 2 0.85,0
153CLV-0807 = smd 4 x 1.6: + 3.05,0; - -3.05,0
153CLV-0505 = smd 3 x 1.6: + 2.2,0; - -2.2,0
150CLZ-0810 = smd 3.5 x 2.5: + 3.25,0; - -3.25,0
153CLV-1010 = smd 4 x 2.5: + 4,0; - -4,0
DO214AC = smd 1.8 x 1.7: A 2.05,0; C -2.05,0
SMA-DO214AC = smd 1.8 x 1.7: A -2.05,0; K 2.05,0
SOT23 = smd 1 x 1.4: 1 -0.95,-1.1; 2 0.95,-1.1; 3 0,1.1
DO41-7.6 = drill 1.1 pad 1.7: A 3.81,0; C -3.81,0
B1,27 = smd 1.27 x 1.27: TP 0,0
1X01 = drill 1.016 octagon: 1 0,0
B3F-10XX = drill 1.016 long: 1 -3.251,2.261; 2 3.251,2.261; 3 -3.251,-2.261; 4 3.251,-2.261
3,0 = hole 3: 0,0
LQFP64 = smd 1.2 x 0.3: 1 -5.75,3.75; 2 -5.75,3.25; 3 -5.75,2.75; 4 -5.75,2.25; 5 -5.75,1.75; 6 -5.75,1.25; 7 -5.75,0.75; 8 -5.75,0.25; 9 -5.75,-0.25; 10 -5.75,-0.75; 11 -5.75,-1.25; 12 -5.75,-1.75; 13 -5.75,-2.25; 14 -5.75,-2.75; 15 -5.75,-3.25; 16 -5.75,-3.75; 33 5.75,-3.75; 34 5.75,-3.25; 35 5.75,-2.75; 36 5.75,-2.25; 37 5.75,-1.75; 38 5.75,-1.25; 39 5.75,-0.75; 40 5.75,-0.25; 41 5.75,0.25; 42 5.75,0.75; 43 5.75,1.25; 44 5.75,1.75; 45 5.75,2.25; 46 5.75,2.75; 47 5.75,3.25; 48 5.75,3.75 | smd 0.3 x 1.2: 17 -3.75,-5.75; 18 -3.25,-5.75; 19 -2.75,-5.75; 20 -2.25,-5.75; 21 -1.75,-5.75; 22 -1.25,-5.75; 23 -0.75,-5.75; 24 -0.25,-5.75; 25 0.25,-5.75; 26 0.75,-5.75; 27 1.25,-5.75; 28 1.75,-5.75; 29 2.25,-5.75; 30 2.75,-5.75; 31 3.25,-5.75; 32 3.75,-5.75; 49 3.75,5.75; 50 3.25,5.75; 51 2.75,5.75; 52 2.25,5.75; 53 1.75,5.75; 54 1.25,5.75; 55 0.75,5.75; 56 0.25,5.75; 57 -0.25,5.75; 58 -0.75,5.75; 59 -1.25,5.75; 60 -1.75,5.75; 61 -2.25,5.75; 62 -2.75,5.75; 63 -3.25,5.75; 64 -3.75,5.75
LPS6235 = smd 0.635 x 1.27: 1 -2.5,0; 2 2.5,0
1X02 = drill 1.016 long: 1 -1.27,0; 2 1.27,0
1X04 = drill 1.016 long: 1 -3.81,0; 2 -1.27,0; 3 1.27,0; 4 3.81,0
HC49UP = smd 5.334 x 1.93: 1 -4.826,0; 2 4.826,0
TO220 = drill 1.118 long: 1 -2.54,-6.35; 2 0,-6.35; 3 2.54,-6.35 | hole 3.302: 0,11.176
R0805 = smd 1.3 x 1.5: 1 -0.95,0; 2 0.95,0
R0603 = smd 1 x 1.1: 1 -0.85,0; 2 0.85,0
1X03 = drill 1.016 long: 1 -2.54,0; 2 0,0; 3 2.54,0
1X05 = drill 1.016 long: 1 -5.08,0; 2 -2.54,0; 3 0,0; 4 2.54,0; 5 5.08,0
SOT230P700X180-4N = smd 1.626 x 0.889: 1 -3.2,2.311; 2 -3.2,0; 3 -3.2,-2.311 | smd 1.626 x 3.175: 4 3.2,0
SOIC127P600X175-8N = smd 1.981 x 0.559: 1 -2.464,1.905; 2 -2.464,0.635; 3 -2.464,-0.635; 4 -2.464,-1.905; 5 2.464,-1.905; 6 2.464,-0.635; 7 2.464,0.635; 8 2.464,1.905
SOT223 = smd 1.219 x 2.235: 1 -2.311,-3.099; 2 0,-3.099; 3 2.311,-3.099 | smd 3.6 x 2.2: 4 0,3.099
SOIC127P600X175-8N' = smd 1.981 x 0.559: 1 -2.362,1.905; 2 -2.362,0.635; 3 -2.362,-0.635; 4 -2.362,-1.905; 5 2.362,-1.905; 6 2.362,-0.635; 7 2.362,0.635; 8 2.362,1.905
BOURNS_PTV09A-4020F-A103_0 = drill 1 pad 1.55 square: 1 -2.5,-7 | drill 1 pad 1.55: 2 0,-7; 3 2.5,-7 | drill 1 pad 1.55 long: 4 -4.4,0; 5 4.4,0

### Placement (x,y rotation side)
C1  15.03,27.94 0 top
C2  16.3,34.5 180 top
C3  26.67,29.21 0 top
C4  19.72,6.32 90 top
C5  20.32,13.97 270 top
C6  45.72,15.24 270 bottom
C7  36.83,16.51 0 bottom
C8  48.26,15.24 270 bottom
C9  52.07,26.67 270 bottom
C10  54.61,26.67 270 bottom
C11  34.29,20.32 270 bottom
C12  57.15,15.24 90 top
C13  50.8,15.24 270 bottom
C14  39.37,33.02 180 bottom
C15  34.29,33.02 270 top
C16  52.07,19.05 0 top
C17  52.07,22.86 90 bottom
C18  55.88,22.86 180 top
C19  90.17,43.18 0 top
C20  90.17,27.94 0 top
C21  90.17,12.7 0 top
C24  83.69,32.13 0 top
C25  64.64,35.94 180 top
C26  69.72,47.37 0 top
C59  44.96,58.93 270 top
C60  51.84,65.58 180 top
C61  57.1,46.76 0 top
C62  33.02,40.64 270 top
D1  10.16,20.32 180 top
D2  24.13,25.4 180 top
D3  83.69,43.56 180 top
D4  78.61,34.67 0 top
D15  63.5,58.42 90 top
DAC1  88.1,63.76 0 top
GND  88,59.91 0 top
GPIO_IN1  97.79,38.1 270 top
GPIO_IN2  97.79,22.86 270 top
GPIO_IN3  97.79,7.62 270 top
H1  3.81,3.81 0 top
H2  3.81,64.77 0 top
H3  106.68,3.81 0 top
H4  106.68,64.77 0 top
IC1  43.18,24.13 180 top
L1  19.05,20.32 0 top
L2  69.85,55.88 90 top
MAGVENT1  48.26,3.81 180 top
MAGVENT2  76.2,3.81 180 top
PROPVENT  38.1,3.81 180 top
PWSPLY  28.11,3.81 0 top
Q1  62.23,26.67 270 top
Q2  30.48,52.07 0 top
R1  90.17,34.29 0 top
R2  90.17,39.37 0 top
R3  90.17,19.05 0 top
R4  90.17,24.13 0 top
R5  90.17,3.81 0 top
R6  90.17,8.89 0 top
R7  49.53,34.29 270 top
R9  69.72,38.48 90 top
R12  83.69,38.48 90 top
R13  69.72,44.83 180 top
R14  72.26,34.67 180 top
R15  64.64,39.75 180 top
R16  65.15,43.56 0 top
R62  55.88,54.61 0 top
R63  57.15,66.04 180 bottom
R64  59.69,54.61 180 top
R65  45.72,50.8 270 top
R66  45.72,43.18 90 top
R67  45.72,46.99 0 top
R68  36.83,39.37 180 top
S1  54.61,34.29 270 top
SEN1  82.9,59.98 0 top
SEN2  93.18,59.98 0 top
SENS1  57.15,3.81 180 top
SENS2  67.31,3.81 180 top
SWDIO_DEBUGGER  11.43,10.16 90 top
U1  22.86,35.56 90 top
U2  27.94,12.7 0 top
U11  55.88,60.96 270 top
U12  39.37,44.45 180 top
U$1  82.55,21.59 90 top
U$2  MCP6002-E/SN  [SOIC127P600X175-8N']  77.34,41.02 0 top
U$4  82.55,8.89 90 top
VR1  103.62,53.63 270 top

### Tracks (layer width: path | path; a pad name or v marks a point on that pad's centre or on a via)
20MA_CLUTCH  (via drill 0.35)
  Top 0.305: PROPVENT.4 34.29,7.62 33.02,8.89 v33.02,17.78 | PROPVENT.4 34.32,3.78 34.89,3.78 | PROPVENT.4 34.29,3.07 | PROPVENT.4 34.28,3.8 33.68,3.8 | Q2.2 31.12,45.72 31.13,45.71 | Q2.2 30.48,44.98 30.52,44.93 | Q2.2 30.42,45.66 29.82,45.66
  Top 0.61: Q2.2 30.48,48.26 30.86,48.64 40.89,48.64 41.91,47.62 41.91,46.43 U12.4
  Bottom 0.305: v33.02,17.78 30.48,20.32 Q2.2 | Q2.2 30.37,45.61 29.87,45.61 | Q2.2 30.51,45.69 31.17,45.69 | Q2.2 30.48,46.63 30.55,46.69
+3V3  (via drill 0.35)
  Top 0.305: 48.89,26.42 IC1.13 | v45.85,26.42 48.89,26.42 | 46.93,21.01 IC1.64 | v36.83,19.18 36.07,19.94 36.07,20.19 36.25,20.38 IC1.48 | C15.+ 37.51,30.82 | 37.51,30.82 38.48,29.84 39.39,29.84 IC1.32 | v45.85,26.42 45.93,26.5 IC1.19 45.93,32.17 v45.47,32.64 | v45.85,26.42 44.7,25.27 44.7,22.48 46.1,21.08 v46.86,21.08 46.93,21.01 | IC1.1 47.56,20.38 46.93,21.01 | v39.12,31.37 38.05,31.37 37.51,30.82 | v50.42,26.42 48.89,26.42
  Top 0.61: v53.09,16.13 54.4,17.44 C12.+ 61.81,17.44 v61.85,17.4 | U2.3 23.22,10.39 22.48,9.65 22.48,9.14 21.84,8.51 19.76,8.51 C4.+ | v93.22,16.76 94.74,15.24 95.25,15.24
  Top 0.813: U2.3 27.41,10.39 28.19,11.18 28.19,21.97 34.29,28.07 C15.+ | R5.1 89.22,2.37 90.09,1.5 96.6,1.5 97.79,2.69 97.79,13.97 96.52,15.24 | R3.1 89.22,17.08 91.06,15.24 95.25,15.24 96.52,15.24 | 96.52,15.24 97.79,16.51 97.79,29.34 95.88,31.24 | R1.1 89.22,32.06 90.04,31.24 95.88,31.24 | 95.88,31.24 96.01,31.24 97.79,33.02 97.79,47.52 96.62,48.69 VR1.3
  Top 1.016: SWDIO_DEBUGGER.1 v13.97,5.08 | v18.03,9.02 19.29,9.02 C4.+
  Bottom 0.305: C10.1 C9.1 50.97,26.42 v50.42,26.42 | C13.1 C8.1 C6.1 | C6.1 45.72,19.94 v46.86,21.08 | v36.83,19.18 37.68,18.33 C7.1 37.68,15.66 38.48,14.86 43.18,14.86 44.41,16.09 C6.1 | v45.47,32.64 42.93,32.64 41.66,31.37 v39.12,31.37
  Bottom 0.61: v53.09,16.13 53.05,16.09 C13.1 | v61.85,17.4 92.58,17.4 v93.22,16.76
  Bottom 1.016: v13.97,5.08 17.91,9.02 v18.03,9.02
+5V  (via drill 0.35)
  Top 0.508: D3.2 80.22,44.66 79.7,44.15 U$2.8
  Top 0.61: U2.1 20.51,15.01 C5.1 | D4.2 81.4,33.57 C24.1 82.84,34.89 v82.8,34.92 | v82.8,47.88 82.8,44.72 D3.2 | U1.3 25.17,30.84 25.82,30.19 C3.1
  Top 0.813: C3.1 24.13,27.52 24.13,18.41 24.76,17.78 | 24.76,17.78 24.76,15.04 U2.1 | C24.1 82.84,2.96 81.4,1.51 68.11,1.51 68.06,1.56 | 68.06,1.56 66.68,1.56 | 58.08,1.51 66.64,1.51 66.68,1.56 | 58.08,1.51 56.35,1.51 56.42,1.58 | 56.42,1.58 33.09,1.58 32.07,2.6 32.07,6.55 v32.51,6.98 | v26.42,19.3 26.29,19.3 24.76,17.78 | 58.08,1.51 57.15,2.44 SENS1.2 57.15,2.31 56.42,1.58 | 66.68,1.56 67.31,2.18 SENS2.2 67.31,2.31 68.06,1.56
  Bottom 0.61: v82.8,47.88 82.93,47.88 83.82,46.99 83.82,35.94 v82.8,34.92
  Bottom 0.813: v32.51,6.98 35.81,10.29 35.81,13.21 29.72,19.3 v26.42,19.3
+12V  (via drill 0.35)
  Top 0.508: R62.1 55.03,56.55 55.24,56.77 U11.6
  Top 0.61: U1.1 20.55,30.76 C1.+ 20.27,25.4 D2.K | C2.1 17.15,33.14 17.93,32.36 U1.1 | U1.1 20.55,34.52 21.72,35.69 24.76,35.69 30.57,41.49 C62.1 33.74,41.49 34.54,42.29 34.54,43.05 35.31,43.81 U12.7 38.35,43.81 39.37,44.83 v39.37,46.99 | C59.+ 41.53,55.68 39.37,53.51 v39.37,50.8
  Top 0.813: R62.1 46.03,54.61 C59.+
  Top 1.016: L1.2 22.08,20.85 D2.K
  Bottom 0.61: v39.37,50.8 v39.37,46.99
+24V  (via drill 0.35)
  Top 0.61: R65.2 55.48,49.95 57.64,47.79 57.64,47.15 58.04,46.76 C61.+
  Top 1.016: PROPVENT.1 41.91,7.62 43.18,8.89 U$4.4 U$1.4 79.45,26.87 v81.15,28.57 | v84.71,28.57 87.25,31.11 87.25,48.13 85.72,49.66 v85.72,49.78 | v82.41,51.72 v76.95,51.72 | D15.C 63.5,51.86 61.1,49.47 C61.+
  Bottom 0.813: 63.53,54.64 D15.C
  Bottom 1.016: v81.15,28.57 v84.71,28.57 | v85.72,49.78 83.79,51.72 v82.41,51.72 | v76.95,51.72 70.09,51.72 67.17,54.64 63.53,54.64
DAC1  (via drill 0.35)
  Top 0.305: R66.1 45.72,34.8 44.58,33.65 44.58,31.88 45.43,31.02 IC1.20
  Top 0.61: R66.1 47.41,42.33 v48.75,43.68 | DAC1.TP 86.98,64.88 v71.91,64.88
  Bottom 0.61: v48.75,43.68 49.39,44.31 49.39,50.66 53.31,54.58 59.13,54.58 69.44,64.88 v71.91,64.88
GND
  pour Top: 0,68.58 0,0 110.49,0 110.49,68.58
  pour Bottom: 0,68.58 0,0 110.49,0 110.49,68.58
GPIO_IN1  (via drill 0.35)
  Top 0.305: IC1.26 42.43,38.62 v44.45,40.64 | v81.91,41.15 v85.85,41.15 | v91.69,41.27 90.93,42.04 89.83,42.04 89.32,41.53
  Top 0.61: C19.1 89.32,41.53 89.32,39.47 R2.1
  Bottom 0.305: v44.45,40.64 44.96,41.15 v81.91,41.15 | v85.85,41.15 91.57,41.15 v91.69,41.27
GPIO_IN2  (via drill 0.35)
  Top 0.305: v43.69,27.43 43.69,27.44 41.93,29.2 IC1.27 | v86.74,26.54 88.14,27.94 C20.1
  Top 0.61: C20.1 89.32,24.23 R4.1
  Bottom 0.305: v43.69,27.43 44.83,28.57 79.37,28.57 81.41,26.54 v86.74,26.54
GPIO_IN3  (via drill 0.35)
  Top 0.305: C21.1 86.99,12.7 v84.96,14.73 | v77.47,12.7 75.69,10.92 44.83,10.92 43.43,12.32 v43.43,16.64 | v43.56,20.83 43.56,21.84 41.43,23.97 IC1.28
  Top 0.61: C21.1 89.22,12.6 R6.1
  Bottom 0.305: v84.96,14.73 79.5,14.73 v77.47,12.7 | v43.43,16.64 43.43,20.7 v43.56,20.83
GPIO_OUT1  (via drill 0.35)
  Top 0.305: U$1.3 85.65,25.6 v85.6,25.65 | v37.59,13.59 34.54,16.64 34.54,18.92 33.27,20.19 v32.26,20.19 | v35.05,24.89 37.42,24.89 IC1.39
  Bottom 0.305: v85.6,25.65 68.15,25.65 53.17,10.67 40.51,10.67 v37.59,13.59 | v32.26,20.19 32.26,22.1 v35.05,24.89
GPIO_OUT2  (via drill 0.35)
  Top 0.305: IC1.40 39.37,24.38 42.42,21.34 v42.42,19.94 | v42.42,16 42.42,12.19 44.45,10.16 76.33,10.16 v77.47,11.3 | v84.96,13.21 85.47,13.21 85.85,12.83 85.85,11.4 U$4.3
  Bottom 0.305: v42.42,19.94 v42.42,16 | v77.47,11.3 83.06,11.3 v84.96,13.21
ISTWERT  (via drill 0.35)
  Top 0.305: R7.2 49.53,29.72 50.55,28.7 50.55,27.81 50.11,27.38 IC1.15 47.06,27.38 v46.99,27.3 | PROPVENT.2 39.37,11.81 40.64,13.08 v40.64,16.13 | PROPVENT.2 39.36,3.8 38.8,3.8 38.81,3.81 PROPVENT.2 | PROPVENT.2 39.37,3.01 | PROPVENT.2 39.96,3.81
  Bottom 0.305: v40.64,16.13 40.64,19.43 46.86,25.65 46.86,27.18 v46.99,27.3
KUPPLUNGSPOTI  (via drill 0.35)
  Top 0.305: v72.52,42.29 71.63,41.4 v71.63,40.39 | v48.26,31.24 48.93,30.57 IC1.16
  Bottom 0.305: v72.52,42.29 72.52,44.58 81.57,53.63 VR1.2 | v71.63,40.39 70.1,38.86 62.23,38.86 57.53,34.16 51.43,34.16 51.31,34.29 v48.26,31.24
MAG_VENTIL1  (via drill 0.35)
  Top 1.016: MAGVENT1.1 52.77,7.05 76.39,7.05 v76.45,6.98 | v87.88,15.49 85.65,17.73 U$1.1
  Bottom 1.016: v76.45,6.98 83.57,6.98 87.88,11.3 v87.88,15.49
MAG_VENTIL2  (via drill 0.35)
  Top 0.813: MAGVENT2.1 v81.28,3.81 | v84.33,3.81 85.65,5.13 U$4.1
  Bottom 0.813: v81.28,3.81 v84.33,3.81
N$1  (via drill 0.35)
  Top 0.305: v39.88,26.67 39.88,28.45 40,28.57 40,29.12 39.97,29.15 39.97,29.83 IC1.31
  Bottom 0.305: C14.1 38.1,32.6 38.1,28.32 39.75,26.67 v39.88,26.67
N$2  (via drill 0.35)
  Top 0.305: v40.39,20.83 39.88,20.32 39.62,20.32 39.06,20.88 IC1.47
  Bottom 0.305: C11.1 40.04,21.17 v40.39,20.83
N$4
  Top 0.61: GPIO_IN1.3 95.53,39.9 95,39.37 R2.2 R1.2 94.97,34.29 GPIO_IN1.4
N$5
  Top 0.305: C16.1 50.55,19.72 50.55,21.97 50.14,22.38 IC1.5
  Top 0.61: Q1.2 61.59,21.21 57.53,21.21 56.9,20.57 51.56,20.57 51.22,20.23 C16.1
N$6  (via drill 0.35)
  Top 0.305: v45.72,22.86 45.74,22.88 IC1.6
  Top 0.61: Q1.1 57.66,26.92 v57.66,24.89
  Bottom 0.305: C17.1 51.94,22.01 46.57,22.01 v45.72,22.86
  Bottom 0.61: v57.66,24.89 57.66,23.11 56.51,21.97 51.98,21.97 51.94,22.01
N$7
  Top 0.61: GPIO_IN2.4 94.97,19.05 R3.2 R4.2 91.25,24 94.61,24 95.53,24.92 GPIO_IN2.3
N$8
  Top 0.305: C18.2 50.13,22.86 49.65,23.34 48.97,23.34 IC1.7 48.97,23.43 49.66,23.43 51.25,25.02 51.69,25.02 52.32,25.65 52.32,31.01 S1.4 | S1.3 S1.4 | S1.3 52.4,37.59 53,37.59 | S1.3 51.79,37.54 51.77,37.56 | S1.3 52.35,38.41 52.37,38.43 | S1.4 51.8,31.04 51.77,31.06 | S1.4 52.91,31.04 52.91,31.03
N$15
  Top 0.305: U$2.1 U$2.2
  Top 0.508: U$2.1 73.41,42.93 71.5,44.83 R13.1
N$17
  Top 0.508: R14.1 73.34,34.8 74.93,34.8 77.09,36.96 77.09,39.5 77.98,40.39 U$2.6 U$2.7
N$19
  Top 0.61: GPIO_IN3.3 95.53,9.3 95.12,8.89 R6.2 R5.2 94.97,3.81 GPIO_IN3.4
N$58
  Top 0.508: C60.1 54.31,65.58 55.24,64.64 U11.3
N$59  (via drill 0.35)
  Top 0.508: v56.51,60.83 U11.7 56.51,56.51 56.73,56.3 R62.2 56.73,53 57.02,52.7 v60.32,52.7 | L2.1 69.85,52.07 67.94,50.16 v66.8,50.16
  Bottom 0.508: R63.1 56.3,61.05 v56.51,60.83 | v66.8,50.16 64.26,52.7 v60.32,52.7
N$60  (via drill 0.35)
  Top 0.508: v57.78,60.83 U11.8
  Bottom 0.508: R63.2 58,61.05 v57.78,60.83
N$61
  Top 0.508: L2.2 67.1,58.38 63.5,61.98 D15.A
  Top 0.61: D15.A 60.83,62.23 59.64,63.42 U11.1
N$62  (via drill 0.35)
  Top 0.508: R64.2 58.84,56.22 v58.8,56.26 | v53.97,61.09 U11.5
  Top 0.61: v49.53,53.34 47.84,51.65 R65.1 | v50.8,55.88 51.56,56.64 53.59,56.64 53.97,57.02 U11.5
  Bottom 0.508: v58.8,56.26 57.53,56.26 55.37,58.42 55.37,60.07 54.36,61.09 v53.97,61.09
  Bottom 0.61: v50.8,55.88 49.53,54.61 v49.53,53.34
N$63
  Top 0.61: U12.2 43.94,43.81 44.16,44.03 R66.2
N$65
  Top 0.305: Q2.3 33.02,46.79 | Q2.3 32.39,45.73 | Q2.3 33.02,44.72
  Top 0.61: Q2.3 33.65,46.35 U12.5
N$67
  Top 0.305: Q2.1 27.94,46.5 27.9,46.54 | Q2.1 28.59,45.72 28.6,45.73 | Q2.1 27.91,45.75 27.32,45.75
  Top 0.61: Q2.1 27.94,44.2 28.7,43.43 33.53,43.43 35.18,45.08 U12.6
N$68  (via drill 0.35)
  Top 0.508: U12.1 v44.07,42.54 | v48.01,46.99 R67.2
  Bottom 0.508: v44.07,42.54 48.01,46.48 v48.01,46.99
N$69
  Top 0.61: U12.8 35.98,41.62 R68.2
N$70
  Top 0.61: R67.1 44.87,46.52 43.43,45.08 U12.3 40.89,45.08 39.88,44.07 39.88,41.57 R68.1
SENSOR1_IN  (via drill 0.35)
  Top 0.508: R9.2 72.45,39.43 73.41,40.39 U$2.3 76.71,40.39 77.34,41.02 v77.34,42.29 | D3.3 83.52,42.29 v81.91,42.29
  Top 0.813: R9.2 69.66,39.37 68.07,39.37 67.44,38.73 v67.44,37.34 | v67.44,33.27 67.44,19.18 v59.94,11.68
  Bottom 0.508: v81.91,42.29 v77.34,42.29
  Bottom 0.813: v67.44,37.34 v67.44,33.27 | v59.94,11.68 59.94,4.06 SENS1.1
SENSOR1_OUT
  Top 0.305: R16.2 63.81,41.27 60.07,41.27 58.67,39.88 50.55,39.88 46.99,36.32 46.99,29.94 IC1.17
  Top 0.508: R16.2 67.37,44.83 R13.2 68.77,47.27 C26.1 68.83,47.41 68.83,49.66 69.47,50.29 72.14,50.29 81.83,59.98 SEN1.TP
SENSOR2_IN  (via drill 0.35)
  Top 0.508: R12.2 82.23,39.43 81.91,39.12 U$2.5 79.7,38.05 78.61,36.96 D4.3
  Top 0.813: v69.85,11.81 76.2,18.16 76.2,34.29 77.68,35.77 D4.3
  Bottom 0.813: SENS2.1 v69.85,11.81
SENSOR2_OUT  (via drill 0.35)
  Top 0.305: IC1.21 44.93,30.76 43.56,32.13 43.56,38.61 v44.45,39.5 | v60.96,39.37 62.23,38.1 64.64,38.1 65.59,39.05 65.59,39.37
  Top 0.508: R14.2 68.2,34.67 66.93,35.94 C25.1 65.59,36.04 65.59,39.37 R15.1 66.42,39.75 v69.09,42.42 | v74.93,48.26 75.14,48.47 76.95,48.47 81.67,48.47 SEN2.TP
  Bottom 0.305: v44.45,39.5 60.83,39.5 v60.96,39.37
  Bottom 0.508: v74.93,48.26 v69.09,42.42
SYS_SWCLK  (via drill 0.35)
  Top 0.305: SWDIO_DEBUGGER.2 13.84,7.62 v14.99,8.76 | v34.54,11.81 38.23,11.81 39.5,13.08 39.5,17.63 39.47,17.65 39.47,18.33 IC1.49 | SWDIO_DEBUGGER.2 11.43,8.18 | 11.43,8.18 | 11.43,8.18 SWDIO_DEBUGGER.2 | SWDIO_DEBUGGER.2 10.69,7.62 10.67,7.64 | SWDIO_DEBUGGER.2 11.43,7.05 11.41,7.03
  Bottom 0.305: v14.99,8.76 18.03,11.81 v34.54,11.81
SYS_SWDIO  (via drill 0.35)
  Top 0.305: SWDIO_DEBUGGER.4 14.22,12.7 v14.73,13.21 | v29.46,21.34 37.24,21.34 37.39,21.34 IC1.46 | SWDIO_DEBUGGER.4 11.43,13.29 | SWDIO_DEBUGGER.4 11.43,12.13 11.41,12.1 | SWDIO_DEBUGGER.4 11.42,12.71 10.74,12.71
  Bottom 0.305: v14.73,13.21 22.86,21.34 v29.46,21.34
V_IN
  Top 0.813: 17.96,6.46 18.14,6.28 24.37,6.28 PWSPLY.1
  Top 1.016: D1.C L1.1 16.51,20.28 16.51,7.91 17.96,6.46

### Text on the board
tNames: X:/10 - Seasons/07 - Season 2019/10 - Car Design/05 - Electronics/02 - PCB Design/Rub Motorsport Logo 2014 black.bmp | X:/10 - Seasons/07 - Season 2019/10 - Car Design/05 - Electronics/02 - PCB Design/Rub Motorsport Logo 2014 black.bmp | PCU-Testboard-v0.1 | PA2 | Kupplung | PB0 | PB1 | SOLL- / WERT | IST- / WERT | +24V | SIGNAL | SIGNAL | PB2 | V_IN | GND | PA4 | GND | PA1 | +24V | GND | PC8 | GND | +5V | PA3 | GND | +5V | PA5 | GND | PC9 | +24V